# EasyEDA Pro project ESP32.epro, schematic Schematic1_1
Board Name: PCB2; Create Date: 2025-07-07; Page Name: P1; Project Name: NATHAN; Schematic Name: Schematic1_1; Update Date: 2025-07-10; Company: 嘉立创EDA; Page Size: A4; Version: V1.0
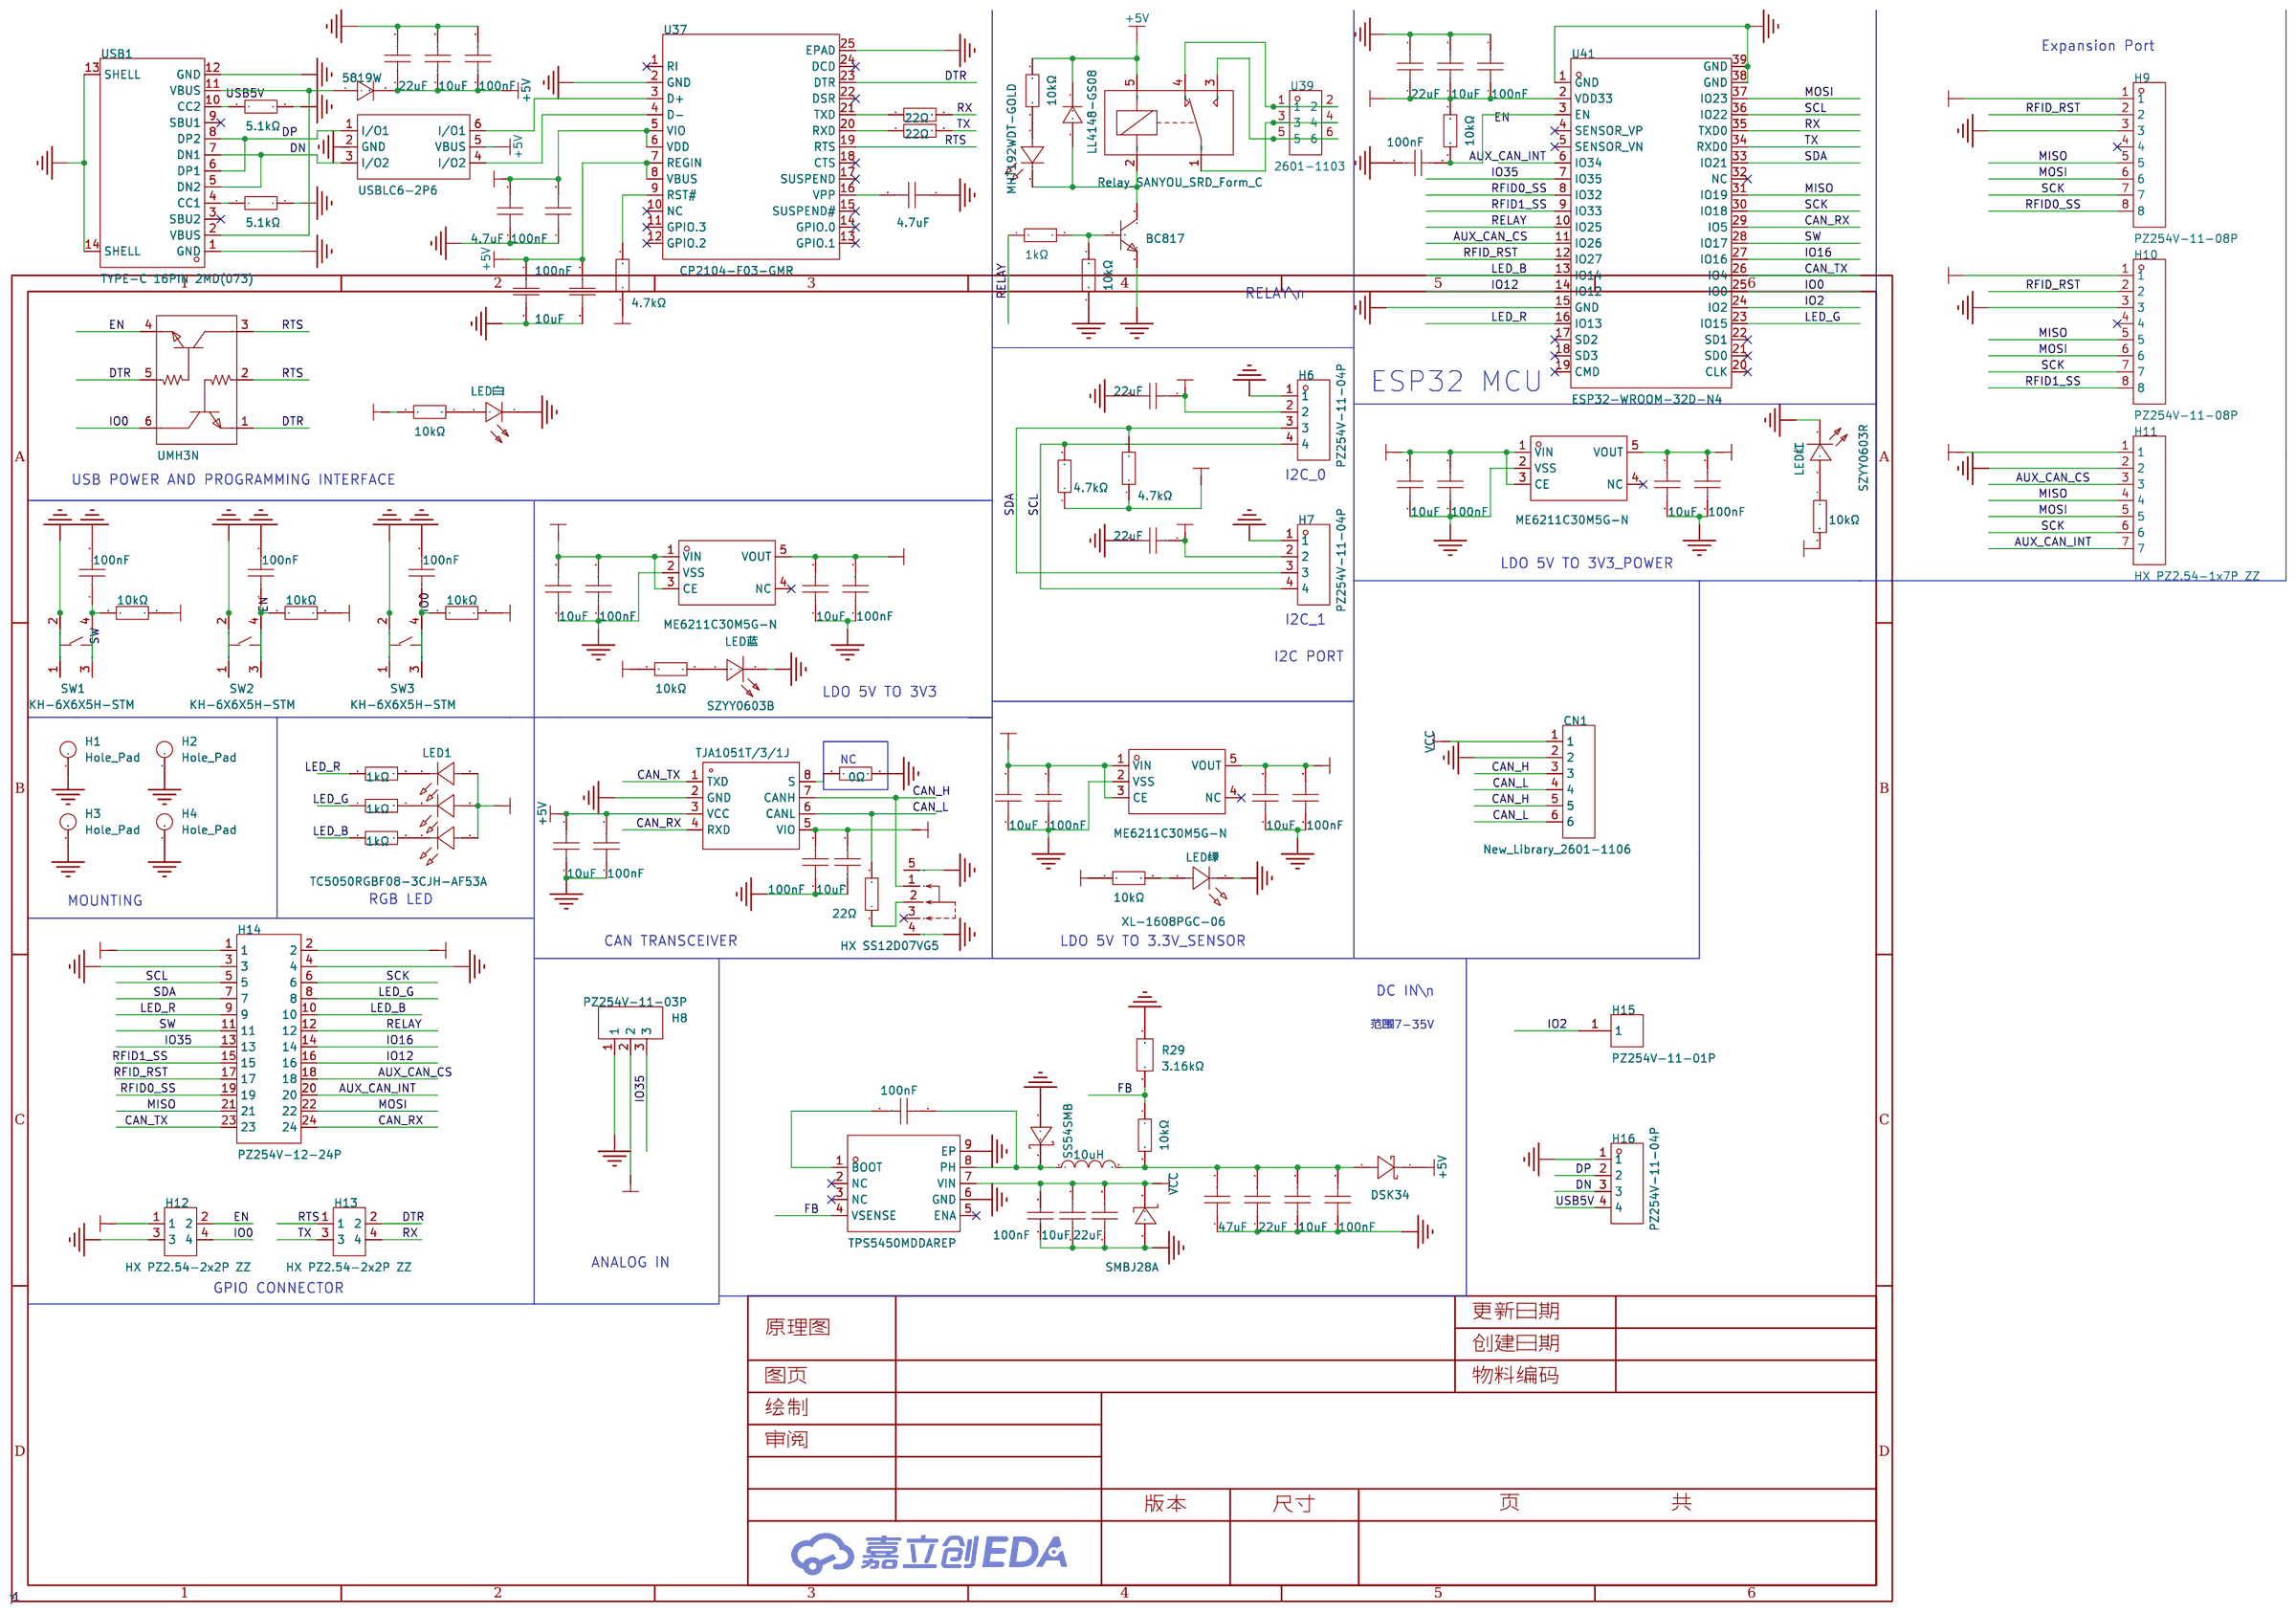
[diagram p0: schematic sheet]

## Parts
C1  22uF  [C0805]
C2  10uF  [C0603]
C3  100nF  [C0603]
C6  4.7uF  [C0603]
C9  100nF  [C0603]
C10  100nF  [C0603]
C11  100nF  [C0603]
C351  10uF  [C0603]
C352  10uF  [C0603]
C353  100nF  [C0603]
C354  100nF  [C0603]
C355  10uF  [C0603]
C356  100nF  [C0603]
C357  10uF  [C0603]
C358  100nF  [C0603]
C359  100nF  [C0603]
C360  4.7uF  [C0603]
C361  10uF  [C0603]
C362  100nF  [C0603]
C363  22uF  [C0805]
C364  22uF  [C0805]
C369  10uF  [C0603]
C370  10uF  [C0603]
C371  100nF  [C0603]
C372  100nF  [C0603]
C373  10uF  [C0603]
C374  100nF  [C0603]
C375  100nF  [C0603]
C376  10uF  [C0603]
C377  22uF  [C0805]
C378  10uF  [C0603]
C379  100nF  [C0603]
C380  100nF  [C0603]
C382  10uF  [C1206]
C383  22uF  [C1206]
C384  100nF  [C1206]
C385  47uF  [C1206]
C386  22uF  [C0805]
C387  10uF  [C0603]
C388  100nF  [C0603]
C389  100nF  [C0603]
CN1  New_Library_2601-1106  [CONN-TH_2601-1106]
D1  USBLC6-2P6  [SOT-666-6_L1.6-W1.2-P0.50-LS1.6-BL]
D2  5819W  [SOD-123_L2.7-W1.6-LS3.7-FD]
D3  LL4148-GS08  [SOD-80_L3.5-W1.5-RD]
D5  SS54SMB  [SMB_L4.6-W3.6-LS5.3-RD]
D6  SMBJ28A  [SMB_L4.6-W3.6-LS5.3-L-FD]
D7  DSK34  [SOD-123FL_L2.7-W1.8-LS3.8-RD]
H1  Hole_Pad  [MountingHole:MountingHole_3.2mm_M3_Pad_Via]
H2  Hole_Pad  [MountingHole:MountingHole_3.2mm_M3_Pad_Via]
H3  Hole_Pad  [MountingHole:MountingHole_3.2mm_M3_Pad_Via]
H4  Hole_Pad  [MountingHole:MountingHole_3.2mm_M3_Pad_Via]
H6  PZ254V-11-04P  [HDR-TH_4P-P2.54-V-M]
H7  PZ254V-11-04P  [HDR-TH_4P-P2.54-V-M]
H8  PZ254V-11-03P  [HDR-TH_3P-P2.54-V-M]
H9  PZ254V-11-08P  [HDR-TH_8P-P2.54-V-M]
H10  PZ254V-11-08P  [HDR-TH_8P-P2.54-V-M]
H11  HX PZ2.54-1x7P ZZ  [HDR-TH_7P-P2.54-V-M]
H12  HX PZ2.54-2x2P ZZ  [HDR-TH_HX-PZ2.54-2X2P-ZZ]
H13  HX PZ2.54-2x2P ZZ  [HDR-TH_HX-PZ2.54-2X2P-ZZ]
H14  PZ254V-12-24P  [HDR-TH_24P-P2.54-V-M-R2-C12-S2.54]
H15  PZ254V-11-01P  [HDR-TH_1P-P2.54-V-M]
H16  PZ254V-11-04P  [HDR-TH_4P-P2.54-V-M]
K1  SANYOU_SRD_Form_C  [Relay_THT:Relay_SPDT_SANYOU_SRD_Series_Form_C]
L12  10uH  [IND-SMD_L5.4-W5.2_FXL0530]
LED1  TC5050RGBF08-3CJH-AF53A  [LED-SMD_6P-L5.0-W5.0-TL_TC5050RGBF08]
LED白  NCD0603W1  [LED0603-RD]
LED红  SZYY0603R  [LED0603-R-RD]
LED绿  XL-1608PGC-06  [LED0603-RD_GREEN]
LED蓝  SZYY0603B  [LED0603-R-RD_BLUE]
Q1  UMH3N  [SC-70-6_L2.2-W1.3-P0.65-LS2.1-BR]
Q2  BC817  [SOT-23-3_L2.9-W1.3-P1.90-LS2.4-BR]
R1  5.1kΩ  [R0603]
R2  5.1kΩ  [R0603]
R4  22Ω  [R0603]
R5  22Ω  [R0603]
R7  10kΩ  [R0603]
R8  10kΩ  [R0603]
R9  10kΩ  [R0603]
R10  10kΩ  [R0603]
R11  10kΩ  [R0603]
R12  1kΩ  [R0603]
R13  1kΩ  [R0603]
R14  1kΩ  [R0603]
R15  0Ω  [R0603]
R16  22Ω  [R0603]
R17  4.7kΩ  [R0603]
R18  10kΩ  [R0603]
R19  10kΩ  [R0603]
R20  1kΩ  [R0603]
R21  4.7kΩ  [R0603]
R22  4.7kΩ  [R0603]
R23  10kΩ  [R0603]
R24  10kΩ  [R0603]
R25  10kΩ  [R0603]
R28  10kΩ  [R0603]
R29  3.16kΩ  [R0603]
SW1  KH-6X6X5H-STM  [SW-SMD_4P-L6.0-W6.0-P4.50-LS9.0_H5.0]
SW2  KH-6X6X5H-STM  [SW-SMD_4P-L6.0-W6.0-P4.50-LS9.0_H5.0]
SW3  KH-6X6X5H-STM  [SW-SMD_4P-L6.0-W6.0-P4.50-LS9.0_H5.0]
U31  ME6211C30M5G-N  [SOT-23-5_L2.9-W1.6-P0.95-LS2.8-BL]
U34  TJA1051T/3/1J  [SOIC-8_L4.9-W3.9-P1.27-LS6.0-BL]
U36  HX SS12D07VG5  [SW-TH_SS12D07VG3]
U37  CP2104-F03-GMR  [QFN-24_L4.0-W4.0-P0.50-BL-EP2.7]
U38  MHT192WDT-GOLD  [LED0603-RD-YELLOW]
U39  2601-1103  [CONN-TH_6P-P3.50_2601-1103]
U40  ME6211C30M5G-N  [SOT-23-5_L2.9-W1.6-P0.95-LS2.8-BL]
U41  ESP32-WROOM-32D-N4  [WIFIM-SMD_39P-L25.5-W18.0-P1.27-BL]
U42  ME6211C30M5G-N  [SOT-23-5_L2.9-W1.6-P0.95-LS2.8-BL]
U43  TPS5450MDDAREP  [POWERPAD-SO-8_L4.9-W3.9-P1.27-LS6.0-BL-EP]
USB1  TYPE-C 16PIN 2MD(073)  [USB-C-SMD_TYPE-C-6PIN-2MD-073]

## Library data of the parts
C1 C363 C364 C377 C386 = CGA0805X5R226M350MT: 容值:22uF;精度:±20%;额定电压:35V;材质(温度系数):X5R;; LCSC Part Name: 22uF ±20% 35V; Supplier Part: C6119901; Manufacturer: HRE(芯声); Supplier Footprint: 0805; JLCPCB Part Class: 扩展库; Datasheet: https://atta.szlcsc.com/upload/public/pdf/source/20231129/D589D0CC4D260F7AC3A77E53B455CCB3.pdf; Supplier: LCSC; Tolerance: ±20%; Voltage Rated: 35V; Temperature Coefficient: X5R
C2 C351 C352 C355 C357 C361 C369 C370 C373 C376 C378 C387 = CL10A106MA8NRNC: 容值:10uF;精度:±20%;额定电压:25V;材质(温度系数):X5R;; LCSC Part Name: 10uF ±20% 25V; Supplier Part: C96446; Manufacturer: SAMSUNG(三星); Supplier Footprint: 0603; JLCPCB Part Class: 基础库; Datasheet: https://atta.szlcsc.com/upload/public/pdf/source/20160218/1457707763339.pdf; Supplier: LCSC; Tolerance: ±20%; Voltage Rated: 25V; Temperature Coefficient: X5R
C3 C9-C11 C353 C354 C356 C358 C359 C362 C371 C372 C374 C375 C379 C380 C388 C389 = CGA0603X7R104K500JT: 容值:100nF;精度:±10%;额定电压:50V;温度系数:X7R;; LCSC Part Name: 100nF ±10% 50V; Supplier Part: C6119867; Manufacturer: HRE(芯声); Supplier Footprint: 0603; JLCPCB Part Class: 扩展库; Datasheet: https://atta.szlcsc.com/upload/public/pdf/source/20250103/C44077DA9E7B3EFAE02F22B6D3D1CBC9.pdf; Supplier: LCSC; Tolerance: ±10%; Voltage Rating: 50V; Temperature Coefficient: X7R
C6 C360 = CGA0603X5R475K250JT: 容值:4.7uF;精度:±10%;额定电压:25V;温度系数:X5R;; LCSC Part Name: 4.7uF ±10% 25V; Supplier Part: C6119856; Manufacturer: HRE(芯声); Supplier Footprint: 0603; JLCPCB Part Class: 扩展库; Supplier: LCSC; Tolerance: ±10%; Voltage Rating: 25V; Temperature Coefficient: X5R
C382 = HGC1206R5106K500NSPJ: 容值:10uF;精度:±10%;额定电压:50V;温度系数:X5R;; LCSC Part Name: 10uF ±10% 50V; Supplier Part: C7432781; Manufacturer: Chinocera(华瓷); Supplier Footprint: 1206; JLCPCB Part Class: 扩展库; Datasheet: https://atta.szlcsc.com/upload/public/pdf/source/20240320/FAC3FEC40A78BC5CCCE96C232A94D860.pdf; Supplier: LCSC; Tolerance: ±10%; Voltage Rating: 50V; Temperature Coefficient: X5R
C383 = CGA1206X5R226M350NT: 容值:22uF;精度:±20%;额定电压:35V;温度系数:X5R;; LCSC Part Name: 22uF ±20% 35V; Supplier Part: C6119969; Manufacturer: HRE(芯声); Supplier Footprint: 1206; JLCPCB Part Class: 扩展库; Supplier: LCSC; Tolerance: ±20%; Voltage Rating: 35V; Temperature Coefficient: X5R
C384 = CL31B104KBCNNNC: 容值:100nF;精度:±10%;额定电压:50V;材质(温度系数):X7R;; LCSC Part Name: 100nF ±10% 50V; Supplier Part: C24497; Manufacturer: SAMSUNG(三星); Supplier Footprint: 1206; JLCPCB Part Class: 基础库; Datasheet: https://atta.szlcsc.com/upload/public/pdf/source/20160218/1457707763339.pdf; Supplier: LCSC; Tolerance: ±10%; Voltage Rated: 50V; Temperature Coefficient: X7R
C385 = HGC1206R5476M250NSPJ: 容值:47uF;精度:±20%;额定电压:25V;温度系数:X5R;; LCSC Part Name: 47uF ±20% 25V; Supplier Part: C22367835; Manufacturer: Chinocera(华瓷); Supplier Footprint: 1206; JLCPCB Part Class: 扩展库; Datasheet: https://atta.szlcsc.com/upload/public/pdf/source/20240326/E6CB0DC43BB858B74F4352229FABFDCA.pdf; Supplier: LCSC; Tolerance: ±20%; Voltage Rating: 25V; Temperature Coefficient: X5R
CN1 = 2601-1106: Supplier Part: C9900153774; Supplier Footprint: 6P; Supplier: LCSC
D1 = USBLC6-2P6_C2827693: 极性:单向;反向截止电压(Vrwm):5V;最大钳位电压:14V;峰值脉冲电流(Ipp):5.5A;峰值脉冲功率(Ppp):80W;击穿电压:6V;; LCSC Part Name: MSL=3; Supplier Part: C2827693; Manufacturer: TECH PUBLIC(台舟); Supplier Footprint: SOT-666-6; JLCPCB Part Class: 扩展库; Datasheet: https://atta.szlcsc.com/upload/public/pdf/source/20210810/36353A9194EA9F4E33F8AE18BE051AEA.pdf; Supplier: LCSC; polarity: 单向; Reverse Stand-Off Voltage (Vrwm): 5V; Maximum Clamping Voltage: 14V; Peak Pulse Current (Ipp): 5.5A; Peak Pulse Power Dissipation (Ppp): 80W; Breakdown Voltage: 6V; Reverse Leakage Current (Ir): 80nA; Number of Lines: 双路; Operating Temperature: -55℃~+125℃; level of protection: IEC 61000-4-2; Type: ESD
D2 = 5819W: 正向压降(Vf):900mV@3A;直流反向耐压(Vr):40V;整流电流:1A;; Supplier Part: C42401890; Manufacturer: MOT(仁懋); Supplier Footprint: SOD-123; Datasheet: https://atta.szlcsc.com/upload/public/pdf/source/20241129/2D139EC0BD1168ECF15291E132570738.pdf; Supplier: LCSC; Voltage - Forward(Vf@If): 900mV@3A; Voltage - DC Reverse(Vr): 40V; Current - Rectified: 1A; Reverse Leakage Current (Ir): 1mA
D3 = LL4148-GS08: 二极管配置:-;正向压降(Vf):860mV@50mA;直流反向耐压(Vr):75V;整流电流:300mA;反向恢复时间(Trr):-;; Supplier Part: C68883; Manufacturer: VISHAY(威世); Supplier Footprint: MiniMELF; JLCPCB Part Class: 扩展库; Datasheet: https://atta.szlcsc.com/upload/public/pdf/source/20160803/1470206543327.pdf; Supplier: LCSC; Voltage - Forward(Vf@If): 860mV@50mA; Voltage - DC Reverse(Vr): 75V; Current - Rectified: 300mA; Reverse Leakage Current (Ir): 5uA@75V
D5 = SS54SMB: schottky,5A 40V VF&lt;0.55V DO-214AA SMB; LCSC Part Name: SS54 SMB; Supplier Part: C511854; Manufacturer: BORN(伯恩半导体); Supplier Footprint: SMB; JLCPCB Part Class: 扩展库; Datasheet: https://atta.szlcsc.com/upload/public/pdf/source/20200413/C511854_F7D668554D39129E820C7896E4694DA5.pdf; Supplier: LCSC
D6 = SMBJ28A: 极性:Unidirectional;峰值脉冲电流（10/1000us）:13.2A;箝位电压:45.4V;击穿电压（最小值）:31.1V;反向关断电压（典型值）:28V;; Supplier Part: C356769; Manufacturer: JJW(捷捷微); Supplier Footprint: SMB(DO-214AA); JLCPCB Part Class: 扩展库; Datasheet: https://atta.szlcsc.com/upload/public/pdf/source/20181226/C356769_111367A690C2F4EEBB1E8F2BF22E2686.pdf; Supplier: LCSC
D7 = DSK34_C7502709: 二极管配置:独立式;正向压降(Vf):550mV@3A;直流反向耐压(Vr):40V;平均整流电流(Io):3A;; LCSC Part Name: 电压:40V 电流:3A; Supplier Part: C7502709; Manufacturer: 宏迦橙; Supplier Footprint: SOD-123FL; JLCPCB Part Class: Extended Part; Datasheet: https://atta.szlcsc.com/upload/public/pdf/source/20230828/8ECF110B7E3B5231119B5EFF852BA7DE.pdf; Supplier: LCSC; Diode Configuration: 独立式; Forward Voltage (Vf@If): 550mV@3A; Reverse Voltage (Vr): 40V; Average Rectified Current (Io): 3A; Reverse Leakage Current (Ir): 500uA; Peak forward surge current: 80A
H1-H4 = Mechanical_MountingHole_Pad: Mounting Hole with connection
H6 H7 H16 = PZ254V-11-04P: 插针结构:1x4P;间距:2.54mm;行距:-;圆针/方针:方针;安装类型:直插;排数:单排;总PIN位数:4P;额定电流:3A;额定电压:250V;配合针长度:6mm;塑高:2.5mm;端接针长度:3mm;触头材质:-;工作温度范围:-40℃~+105℃;颜色:黑色;; LCSC Part Name: 间距:2.54mm 1x4P 直插 方针; Supplier Part: C2691448; Manufacturer: XFCN(兴飞); Supplier Footprint: 插件,P=2.54mm; JLCPCB Part Class: 扩展库; Datasheet: https://atta.szlcsc.com/upload/public/pdf/source/20200309/C492403_F9F19131791D08044AD4F84F8E751A34.pdf; Supplier: LCSC; Pin Structure: 1x4P; Pitch: 2.54mm; Circluar Pins/Square Pins: 方针; Mounting Type: 直插; Number of Rows: 单排; Number of Pins: 4P; Current Rating (Max): 3A; Voltage Rating (Max): 250V; Length of Mating Pin: 6mm; Insulation Height: 2.5mm; Length of End Connection Pin: 3mm; Operating Temperature Range: -40℃~+105℃; Color: 黑色
H8 = PZ254V-11-03P: 插针结构:1x3P;间距:2.54mm;行距:-;圆针/方针:方针;安装方式:直插;排数:单排;总PIN位数:3P;额定电流:3A;额定电压:250V;配合针长度:6mm;塑高:2.5mm;端接针长度:3mm;工作温度:-40℃~+105℃;颜色:黑色;; LCSC Part Name: 1x3P 间距:2.54mm 方针 直插; Supplier Part: C2937625; Manufacturer: XFCN(兴飞); Supplier Footprint: 插件,P=2.54mm; JLCPCB Part Class: 扩展库; Datasheet: https://atta.szlcsc.com/upload/public/pdf/source/20200309/C492402_8335C3D49C4E4C618838D59BB1D024C1.pdf; Supplier: LCSC; Pin Structure: 1x3P; Pitch: 2.54mm; Circluar Pins/Square Pins: 方针; Mounting Type: 直插; Number of Rows: 单排; Number of Pins: 3P; Current Rating: 3A; Voltage Rating (Max): 250V; Length of Mating Pin: 6mm; Insulation Height: 2.5mm; Length of End Connection Pin: 3mm; Operating Temperature: -40℃~+105℃; Color: 黑色
H9 H10 = PZ254V-11-08P: 插针结构:1x8P;间距:2.54mm;行距:-;圆针/方针:方针;安装类型:直插;排数:单排;总PIN位数:8P;额定电流:-;额定电压:-;配合针长度:6mm;塑高:2.5mm;端接针长度:3mm;触头材质:黄铜;触头镀层:-;工作温度范围:-40℃~+105℃;颜色:黑色;; LCSC Part Name: 间距:2.54mm 1x8P 直插 方针; Supplier Part: C492407; Manufacturer: XFCN(兴飞); Supplier Footprint: 插件,P=2.54mm; JLCPCB Part Class: 扩展库; Datasheet: https://atta.szlcsc.com/upload/public/pdf/source/20200309/C492407_83A6FB26A2233368EDB9516968EC6149.pdf; Supplier: LCSC; Pin Structure: 1x8P; Pitch: 2.54mm; Circluar Pins/Square Pins: 方针; Mounting Type: 直插; Number of Rows: 单排; Number of Pins: 8P; Length of Mating Pin: 6mm; Insulation Height: 2.5mm; Length of End Connection Pin: 3mm; Contact Material: 黄铜; Operating Temperature Range: -40℃~+105℃; Color: 黑色
H11 = HX PZ2.54-1x7P ZZ: 插针结构:1x7P;间距:2.54mm;行距:-;圆针/方针:方针;安装方式:直插;排数:单排;总PIN位数:7P;额定电流:3A;额定电压:-;配合针长度:6mm;塑高:2.5mm;端接针长度:3mm;触头材质:黄铜;触头镀层:金;工作温度:-40℃~+105℃;颜色:黑色;; LCSC Part Name: 1x7P 间距:2.54mm 方针 直插; Supplier Part: C32713273; Manufacturer: hanxia(韩下); Supplier Footprint: 插件,P=2.54mm; JLCPCB Part Class: 扩展库; Datasheet: https://atta.szlcsc.com/upload/public/pdf/source/20240723/943E46E17BFD6F6457BB8E431625ECB3.pdf; Supplier: LCSC; Pin Structure: 1x7P; Pitch: 2.54mm; Circluar Pins/Square Pins: 方针; Mounting Type: 直插; Number of Rows: 单排; Number of Pins: 7P; Current Rating: 3A; Length of Mating Pin: 6mm; Insulation Height: 2.5mm; Length of End Connection Pin: 3mm; Contact Material: 黄铜; Contact Plating: 金; Operating Temperature: -40℃~+105℃; Color: 黑色
H12 H13 = HX PZ2.54-2x2P ZZ: 插针结构:2x2P;间距:2.54mm;行距:2.54mm;圆针/方针:方针;安装方式:直插;排数:双排;总PIN位数:4P;额定电流:3A;额定电压:-;配合针长度:6mm;塑高:2.5mm;端接针长度:3mm;触头材质:黄铜;触头镀层:金;工作温度:-40℃~+105℃;颜色:黑色;; LCSC Part Name: 2x2P 间距:2.54mm 方针 直插; Supplier Part: C32713275; Manufacturer: hanxia(韩下); Supplier Footprint: 插件,P=2.54mm; JLCPCB Part Class: 扩展库; Datasheet: https://atta.szlcsc.com/upload/public/pdf/source/20240723/CE5FF0E3D3DC0CA9D26CA3411A561CD4.pdf; Supplier: LCSC; Pin Structure: 2x2P; Pitch: 2.54mm; Row Spacing: 2.54mm; Circluar Pins/Square Pins: 方针; Mounting Type: 直插; Number of Rows: 双排; Number of Pins: 4P; Current Rating: 3A; Length of Mating Pin: 6mm; Insulation Height: 2.5mm; Length of End Connection Pin: 3mm; Contact Material: 黄铜; Contact Plating: 金; Operating Temperature: -40℃~+105℃; Color: 黑色
H14 = PZ254V-12-24P: 插针结构:2x12P;间距:2.54mm;行距:2.54mm;圆针/方针:方针;安装方式:直插;排数:双排;总PIN位数:24P;额定电流:-;额定电压:-;配合针长度:6mm;塑高:2.5mm;端接针长度:3mm;触头材质:黄铜;触头镀层:-;工作温度:-40℃~+105℃;颜色:黑色;; LCSC Part Name: 2x12P 间距:2.54mm 方针 直插; Supplier Part: C492429; Manufacturer: XFCN(兴飞); Supplier Footprint: 插件,P=2.54mm; JLCPCB Part Class: 扩展库; Datasheet: https://atta.szlcsc.com/upload/public/pdf/source/20200309/C492429_A90DEF30FD4D9CDC2C3DDFC5EAF9C00B.pdf; Supplier: LCSC; Pin Structure: 2x12P; Pitch: 2.54mm; Row Spacing: 2.54mm; Circluar Pins/Square Pins: 方针; Mounting Type: 直插; Number of Rows: 双排; Number of Pins: 24P; Length of Mating Pin: 6mm; Insulation Height: 2.5mm; Length of End Connection Pin: 3mm; Contact Material: 黄铜; Operating Temperature: -40℃~+105℃; Color: 黑色
H15 = PZ254V-11-01P: 插针结构:1x1P;间距:2.54mm;行距:-;圆针/方针:方针;安装方式:直插;排数:单排;总PIN位数:1P;额定电流:-;额定电压:-;配合针长度:6mm;塑高:2.5mm;端接针长度:3mm;触头材质:黄铜;触头镀层:-;工作温度:-40℃~+105℃;颜色:黑色;; LCSC Part Name: 1x1P 间距:2.54mm 方针 直插; Supplier Part: C492400; Manufacturer: XFCN(兴飞); Supplier Footprint: 插件,P=2.54mm; JLCPCB Part Class: 扩展库; Datasheet: https://atta.szlcsc.com/upload/public/pdf/source/20200309/C492400_46876A5B545F5AE6B8D4A09C46E276E8.pdf; Supplier: LCSC; Pin Structure: 1x1P; Pitch: 2.54mm; Circluar Pins/Square Pins: 方针; Mounting Type: 直插; Number of Rows: 单排; Number of Pins: 1P; Length of Mating Pin: 6mm; Insulation Height: 2.5mm; Length of End Connection Pin: 3mm; Contact Material: 黄铜; Operating Temperature: -40℃~+105℃; Color: 黑色
K1 = Relay_SANYOU_SRD_Form_C: User doc link: http://www.sanyourelay.ca/public/products/pdf/SRD.pdf
L12 = FXL0530-100-M: 电感值:10uH;精度:±20%;额定电流:3.2A;饱和电流(Isat):3.5A;类型:一体成型电感;; LCSC Part Name: 10uH ±20% 3.5A; Supplier Part: C177248; Manufacturer: cjiang(长江微电); Supplier Footprint: SMD,5.2x5.4mm; JLCPCB Part Class: 扩展库; Datasheet: https://atta.szlcsc.com/upload/public/pdf/source/20230516/4BF6F9C76E81720F52A39ED5FFFA18B4.pdf; Supplier: LCSC; Tolerance: ±20%; Rated Current: 3.2A; Saturation Current (Isat): 3.5A; DC Resistance (DCR): 125mΩ; Type: 一体成型电感
LED1 = TC5050RGBF08-3CJH-AF53A: 5050RGB，0.2W 20mA; LCSC Part Name: RGB三色; Supplier Part: C784540; Manufacturer: TCWIN(天成); Supplier Footprint: SMD5050; JLCPCB Part Class: 扩展库; Datasheet: https://atta.szlcsc.com/upload/public/pdf/source/20230731/34B1F7048EB892D234C2083EEE9FB085.pdf; Supplier: LCSC; Operating Temperature: -40℃~+85℃
LED白 = NCD0603W1: 发光颜色:白色;正向电压(VF):2.6V~3.6V;功率:72mW;正向电流:5mA;透镜颜色:雾状黄透镜;发光强度:200mcd~300mcd;发光角度:130°;工作温度:-30℃~+85℃;; Supplier Part: C84265; Manufacturer: 国星光电; Supplier Footprint: 0603; JLCPCB Part Class: 扩展库; Datasheet: https://atta.szlcsc.com/upload/public/pdf/source/20200820/C84265_479E6193713348A548E5CD6D9278BF16.pdf; Supplier: LCSC; Emitted Color: 白色; Forward Voltage (VF): 2.6V~3.6V; Power Dissipation: 72mW; Forward Current: 5mA; Lens Color: 雾状黄透镜; Luminous Intensity: 200mcd~300mcd; Viewing Angle: 130°; Operating Temperature: -30℃~+85℃
LED红 = SZYY0603R: 发光颜色:红色;功率:40mW;正向电流:20mA;主波长:615nm~630nm;二极管配置:-;透镜颜色:无色透明透镜;色温:-;发光角度:120°;载带方式:-;工作温度:-40℃~+85℃;; LCSC Part Name: 红灯; Supplier Part: C434419; Manufacturer: yongyu(永裕光电); Supplier Footprint: 0603; JLCPCB Part Class: 扩展库; Datasheet: https://atta.szlcsc.com/upload/public/pdf/source/20191204/C434419_0B955C1F73FF88449D9A795B6FF49070.pdf; Supplier: LCSC; Emitted Color: 红色; Power Dissipation: 40mW; Forward Current: 20mA; Dominant Wavelength: 615nm~630nm; Peak Wavelength: 645nm; Lens Color: 无色透明透镜; Viewing Angle: 120°; Operating Temperature: -40℃~+85℃
LED绿 = XL-1608PGC-06: 灯头类型:-;发光颜色:翠绿色;正向电压(VF):2.6V~3V;功率:75mW;正向电流:5mA;主波长:505nm~540nm;二极管配置:-;透镜颜色:绿色透镜;色温:-;发光强度:299mcd;发光角度:130°;载带方式:正贴;工作温度:-;; Supplier Part: C7371905; Manufacturer: XINGLIGHT(成兴光); Supplier Footprint: 0603; JLCPCB Part Class: 扩展库; Datasheet: https://atta.szlcsc.com/upload/public/pdf/source/20240218/2F8A7AF596DEEB38157DAB7856E382C0.pdf; Supplier: LCSC; Emitted Color: 翠绿色; Forward Voltage (VF): 2.6V~3V; Power Dissipation: 75mW; Forward Current: 5mA; Dominant Wavelength: 505nm~540nm; Peak Wavelength: 530nm; Lens Color: 绿色透镜; Luminous Intensity: 299mcd; Viewing Angle: 130°; Mounting Sytle: 正贴
LED蓝 = SZYY0603B: 发光颜色:蓝色;功率:100mW;正向电流:5mA;主波长:460nm~475nm;二极管配置:-;透镜颜色:无色透明透镜;色温:-;发光角度:120°;载带方式:-;工作温度:-40℃~+85℃;; LCSC Part Name: 蓝灯; Supplier Part: C434421; Manufacturer: yongyu(永裕光电); Supplier Footprint: 0603; JLCPCB Part Class: 扩展库; Datasheet: https://atta.szlcsc.com/upload/public/pdf/source/20191204/C434421_A4F05E4DF64B0F36639806529E783B5C.pdf; Supplier: LCSC; Emitted Color: 蓝色; Power Dissipation: 100mW; Forward Current: 5mA; Dominant Wavelength: 460nm~475nm; Peak Wavelength: 469nm; Lens Color: 无色透明透镜; Viewing Angle: 120°; Operating Temperature: -40℃~+85℃
Q1 = UMH3N: 晶体管类型:-;集射极击穿电压(Vceo):50V;集电极电流(Ic):100mA;耗散功率(Pd):150mW;直流电流增益(hFE):100@1mA,5V;; Supplier Part: C62892; Manufacturer: CJ(江苏长电/长晶); Supplier Footprint: SC-70-6(SOT-363); JLCPCB Part Class: 扩展库; Datasheet: https://atta.szlcsc.com/upload/public/pdf/source/20151109/1457707575095.pdf; Supplier: LCSC; Collector - Emitter Voltage VCEO: 50V; Current - Collector(Ic): 100mA; Pd - Power Dissipation: 150mW; DC Current Gain: 100@1mA,5V; Input Resistor: 6.11kΩ; Operating Temperature: -55℃~+150℃
Q2 = BC817_C916383: 晶体管类型:NPN;集电极电流(Ic):500mA;集射极击穿电压(Vceo):45V;耗散功率(Pd):300mW;直流电流增益(hFE):-;; Supplier Part: C916383; Manufacturer: JSMSEMI(杰盛微); Supplier Footprint: SOT-23; JLCPCB Part Class: 扩展库; Datasheet: https://atta.szlcsc.com/upload/public/pdf/source/20230630/78AB950D26E0439A5E0071F02FAA6E46.pdf; Supplier: LCSC; type: NPN; Current - Collector(Ic): 500mA; Collector - Emitter Voltage VCEO: 45V; Pd - Power Dissipation: 300mW; Transition frequency(fT): 100MHz; Current - Collector Cutoff: 100nA; Vce Saturation(VCE(sat)): 700mV
R1 R2 = 0603WAF5101T5E: 电阻类型:厚膜电阻;阻值:5.1kΩ;精度:±1%;功率:100mW;最大工作电压:75V;温度系数:±100ppm/℃;; LCSC Part Name: 5.1kΩ ±1% 100mW 厚膜电阻; Supplier Part: C23186; Manufacturer: UNI-ROYAL(厚声); Supplier Footprint: 0603; JLCPCB Part Class: 基础库; Datasheet: https://atta.szlcsc.com/upload/public/pdf/source/20200306/C422600_1E6D84923E4A46A82E41ADD87F860B5C.pdf; Supplier: LCSC; Type: 厚膜电阻; Tolerance: ±1%; Power(Watts): 100mW; Overload Voltage (Max): 75V; Temperature Coefficient: ±100ppm/℃; Operating Temperature Range: -55℃~+155℃
R4 R5 R16 = 0603WAF220JT5E: 电阻类型:厚膜电阻;阻值:22Ω;精度:±1%;功率:100mW;最大工作电压:75V;温度系数:±100ppm/℃;; LCSC Part Name: 22Ω ±1% 100mW 厚膜电阻; Supplier Part: C23345; Manufacturer: UNI-ROYAL(厚声); Supplier Footprint: 0603; JLCPCB Part Class: 基础库; Datasheet: https://atta.szlcsc.com/upload/public/pdf/source/20200306/C422600_1E6D84923E4A46A82E41ADD87F860B5C.pdf; Supplier: LCSC; Type: 厚膜电阻; Tolerance: ±1%; Power(Watts): 100mW; Overload Voltage (Max): 75V; Temperature Coefficient: ±100ppm/℃; Operating Temperature Range: -55℃~+155℃
R7-R11 R18 R19 R23-R25 R28 = 0603WAF1002T5E: 电阻类型:厚膜电阻;阻值:10kΩ;精度:±1%;功率:100mW;工作电压:75V;温度系数:±100ppm/℃;; LCSC Part Name: 厚膜电阻 10kΩ ±1% 100mW; Supplier Part: C25804; Manufacturer: UNI-ROYAL(厚声); Supplier Footprint: 0603; JLCPCB Part Class: 基础库; Datasheet: https://atta.szlcsc.com/upload/public/pdf/source/20200306/C422600_1E6D84923E4A46A82E41ADD87F860B5C.pdf; Supplier: LCSC; Type: 厚膜电阻; Tolerance: ±1%; Power(Watts): 100mW; Voltage-Supply(Max): 75V; Temperature Coefficient: ±100ppm/℃; Operating Temperature: -55℃~+155℃
R12-R14 R20 = 0603WAF1001T5E: 电阻类型:厚膜电阻;阻值:1kΩ;精度:±1%;功率:100mW;最大工作电压:75V;温度系数:±100ppm/℃;; LCSC Part Name: 1kΩ ±1% 100mW 厚膜电阻; Supplier Part: C21190; Manufacturer: UNI-ROYAL(厚声); Supplier Footprint: 0603; JLCPCB Part Class: 基础库; Datasheet: https://atta.szlcsc.com/upload/public/pdf/source/20200306/C422600_1E6D84923E4A46A82E41ADD87F860B5C.pdf; Supplier: LCSC; Type: 厚膜电阻; Tolerance: ±1%; Power(Watts): 100mW; Overload Voltage (Max): 75V; Temperature Coefficient: ±100ppm/℃; Operating Temperature Range: -55℃~+155℃
R15 = 0603WAF0000T5E: 电阻类型:厚膜电阻;阻值:0Ω;精度:±1%;功率:100mW;最大工作电压:75V;; LCSC Part Name: 0Ω ±1% 100mW 厚膜电阻; Supplier Part: C21189; Manufacturer: UNI-ROYAL(厚声); Supplier Footprint: 0603; JLCPCB Part Class: 基础库; Datasheet: https://atta.szlcsc.com/upload/public/pdf/source/20200306/C422600_1E6D84923E4A46A82E41ADD87F860B5C.pdf; Supplier: LCSC; Type: 厚膜电阻; Tolerance: ±1%; Power(Watts): 100mW; Overload Voltage (Max): 75V; Operating Temperature Range: -55℃~+155℃
R17 R21 R22 = 0603WAF4701T5E: 电阻类型:厚膜电阻;阻值:4.7kΩ;精度:±1%;功率:100mW;最大工作电压:75V;温度系数:±100ppm/℃;; LCSC Part Name: 4.7kΩ ±1% 100mW 厚膜电阻; Supplier Part: C23162; Manufacturer: UNI-ROYAL(厚声); Supplier Footprint: 0603; JLCPCB Part Class: 基础库; Datasheet: https://atta.szlcsc.com/upload/public/pdf/source/20200306/C422600_1E6D84923E4A46A82E41ADD87F860B5C.pdf; Supplier: LCSC; Type: 厚膜电阻; Tolerance: ±1%; Power(Watts): 100mW; Overload Voltage (Max): 75V; Temperature Coefficient: ±100ppm/℃; Operating Temperature Range: -55℃~+155℃
R29 = FRC0603F3161TS: 电阻类型:厚膜电阻;阻值:3.16kΩ;精度:±1%;功率:100mW;最大工作电压:75V;温度系数:±100ppm/℃;; LCSC Part Name: 3.16kΩ ±1% 100mW 厚膜电阻; Supplier Part: C2930087; Manufacturer: FOJAN(富捷); Supplier Footprint: 0603; JLCPCB Part Class: 扩展库; Datasheet: https://atta.szlcsc.com/upload/public/pdf/source/20211221/925EC7D7225764EE0046F22065062C87.pdf; Supplier: LCSC; Type: 厚膜电阻; Tolerance: ±1%; Power(Watts): 100mW; Overload Voltage (Max): 75V; Temperature Coefficient: ±100ppm/℃; Operating Temperature Range: -55℃~+155℃
SW1-SW3 = KH-6X6X5H-STM: 电路结构:单刀单掷;按钮形状:圆形按钮;安装方式:立贴;开关长度:6mm;开关宽度:6mm;开关高度:5mm;带支架:不带;触点电流:50mA;额定电压(DC):12V;机械寿命:8万次;; LCSC Part Name: 6*6*5mm 立贴 轻触开关; Supplier Part: C2837531; Manufacturer: kinghelm(金航标); Supplier Footprint: SMD; JLCPCB Part Class: 扩展库; Datasheet: https://atta.szlcsc.com/upload/public/pdf/source/20210608/C2837531_45E87AB996CE723B09405FF2EA209C4C.pdf; Supplier: LCSC; Circuit: 单刀单掷; Actuator Style: 圆形按钮; Mounting Style: 立贴; Switch Length: 6mm; Switch Width: 6mm; Switch Height: 5mm; Strike Gundam: 不带; Contact Current: 50mA; Voltage Rating (DC): 12V; Actuator/Cap Color: 黑色; Pin Style: 鸥翼型; Mechanical Life: 8万次
U31 U40 U42 = ME6211C30M5G-N: 输出类型:固定;最大输入电压:6V;输出电压:3V;最大输出电流:500mA;电源纹波抑制比(PSRR):-;输出极性:正极;; LCSC Part Name: 输入6V 输出3V 500mA; Supplier Part: C403651; Manufacturer: MICRONE(南京微盟); Supplier Footprint: SOT-23-5; JLCPCB Part Class: 扩展库; Datasheet: https://atta.szlcsc.com/upload/public/pdf/source/20190709/C403651_B6C31F2E850C49363974D5C4E4AF6FD2.pdf; Supplier: LCSC; Output Type: 固定; Maximum Input Voltage: 6V; Output Voltage: 3V; MAX Output Current: 500mA; Dropout Voltage: 210mV@(200mA); Output Polarity: 正极; Number of Outputs: 1
U34 = TJA1051T/3/1J: 类型:-;数据速率:5Mbps;; Supplier Part: C38695; Manufacturer: NXP(恩智浦); Supplier Footprint: SOIC-8-150mil; JLCPCB Part Class: 扩展库; Datasheet: https://www.nxp.com/docs/en/data-sheet/TJA1051.pdf; Supplier: LCSC; Data Rate: 5Mbps; Supply Voltage: 4.5V~5.5V; Supply Current: 5mA; Operating Temperature: -40℃~+150℃
U36 = HX SS12D07VG5: 电路结构:单刀双掷;安装方式:直插;开关颜色:黑色;额定电流:300mA;额定电压:50V;工作寿命:1万次;; LCSC Part Name: 柄长5mm 直插二档 滑动开关; Supplier Part: C5149827; Manufacturer: hanxia(韩下); Supplier Footprint: 插件; JLCPCB Part Class: 扩展库; Datasheet: https://atta.szlcsc.com/upload/public/pdf/source/20250218/B4530D8C2A56F967E8FB7869762EB22F.pdf; Supplier: LCSC; Circuit: 单刀双掷; Actuator Style: 矩形柱状; Termination Style: PC引脚; Length: 8.7mm; Width: 4.4mm; Switch Height: 9.7mm; Mounting Type: 直插; Actuator Color: 黑色; Current Rating: 300mA; Voltage Rating: 50V; Life: 1万次; Operating Temperature: -25℃~+70℃
U37 = CP2104-F03-GMR: 应用功能:USB转UART;接口协议:-;数据速率:2Mbps;; LCSC Part Name: 单片USB到UART桥接控制器 USB转UART桥接芯片; Supplier Part: C47742; Manufacturer: SKYWORKS/SILICON LABS(芯科); Supplier Footprint: QFN-24-EP(4x4); JLCPCB Part Class: 扩展库; Datasheet: https://atta.szlcsc.com/upload/public/pdf/source/20150504/1457707282429.pdf; Supplier: LCSC; Applications Function: USB转UART; Supply Voltage: 1.8V；3V~3.6V; Data Rate: 2Mbps; Operating Temperature: -40℃~+85℃
U38 = MHT192WDT-GOLD: 发光颜色:黄色;功率:60mW;正向电流:5mA;主波长:-;二极管配置:-;透镜颜色:雾状黄透镜;色温:-;发光角度:130°;载带方式:-;工作温度:-40℃~+85℃;; LCSC Part Name: 黄灯; Supplier Part: C2837383; Manufacturer: MEIHUA(美华); Supplier Footprint: 0603; JLCPCB Part Class: 扩展库; Datasheet: https://atta.szlcsc.com/upload/public/pdf/source/20210603/C2837383_668F4ACD0E233D894D29F8F8B9EAEF1D.pdf; Supplier: LCSC; Emitted Color: 黄色; Power Dissipation: 60mW; Forward Current: 5mA; Lens Color: 雾状黄透镜; Viewing Angle: 130°; Operating Temperature: -40℃~+85℃
U39 = 2601-1103: PCB 接线端子; 操作手柄; 1.5 mm2; 焊针间距 3.5 mm; 3极; 推入式笼夹; 1,50 mm2; 灰色; Supplier Part: C7472698; Manufacturer: WAGO(万可); Supplier Footprint: 插件,P=3.5mm; JLCPCB Part Class: 扩展库; Datasheet: https://atta.szlcsc.com/upload/public/pdf/source/20240516/26CB940F61CBBD7B4897536DBA61AF46.pdf; Supplier: LCSC
U41 = ESP32-WROOM-32D-N4: ESP32-WROOM-32D 集成 ESP32-D0WD，功能强大，用途广泛，可以用于低功耗传感器网络和要求极高的任务，例如语音编码、音频流和 MP3 解码等。; LCSC Part Name: 通用型Wi-Fi+BT+BLE MCU模组; Supplier Part: C473012; Manufacturer: ESPRESSIF(乐鑫); Supplier Footprint: SMD,18x25.5mm; JLCPCB Part Class: 扩展库; Datasheet: https://atta.szlcsc.com/upload/public/pdf/source/20191225/C473012_1E74417EE995DBCF17C94BD318A37DAB.pdf; Supplier: LCSC
U43 = TPS5450MDDAREP: 功能类型:降压型;输出类型:可调;工作电压:5.5V~36V;输出电压:1.221V~32.04V;输出电流:5A;; Supplier Part: C2071671; Manufacturer: TI(德州仪器); Supplier Footprint: SO-8; JLCPCB Part Class: 扩展库; Datasheet: https://www.ti.com/cn/lit/gpn/tps5450-ep; Supplier: LCSC; Function: 降压型; Output Type: 可调; Voltage - Supply: 5.5V~36V; Output Voltage: 1.221V~32.04V; Output Current: 5A; Frequency - Switching: 500kHz; Operating Temperature: -55℃~+125℃@(TJ); Synchronous Rectifier: 否; Number of Outputs: 1; Topology: 降压式; Switch tube (built-in/external): 内置
USB1 = TYPE-C 16PIN 2MD(073): 连接器类型:Type-C;协议标准:USB 3.1;公母:母;安装方式:卧贴;触点数量:16P;端口数量:1;额定电流 - 电源:3A;工作温度:-25℃~+85℃;; LCSC Part Name: Type-C 母 卧贴; Supplier Part: C2765186; Manufacturer: SHOU HAN(首韩); Supplier Footprint: SMD; JLCPCB Part Class: 扩展库; Datasheet: https://atta.szlcsc.com/upload/public/pdf/source/20250506/FFB74EDFDFA0AC372CE4A8E4F739CCEF.pdf; Supplier: LCSC; Connector Type: Type-C; Protocol Standard: USB 3.1; Gender: 母; Mounting Type: 卧贴; Number of Contacts: 16P; Number of Ports: 1; Current Rating-Power: 3A; Voltage Rating: 5V; Connect-Disconnect Life: 5千次; Detection color: 黑色; Operating Temperature: -25℃~+85℃

## Nets
3V3: C352.2 C354.2 C357.2 C358.2 H12.1 H14.2 LED1.1(+) LED1.2(+) LED1.3(+) R8.2 R9.2 R10.2 R11.2 U31.5(VOUT) U34.5(VIO)
3V3_POWER: C373.2 C375.2 C377.1 C378.1 C379.1 R24.2 R25.1 U41.2(VDD33) U42.5(VOUT)
+5V: C1.1 C2.1 C3.1 C351.2 C353.2 C355.2 C356.2 C361.2 C362.2 C369.2 C371.2 C374.2 C376.2 D1.5(VBUS) D2.2(C) D3.1(C) D7.1(K) H14.1 K1.5 R18.1 U31.1(VIN) U31.3(CE) U34.3(VCC) U37.7(REGIN) U37.8(VBUS) U40.1(VIN) U40.3(CE) U42.1(VIN) U42.3(CE)
GND: C1.2 C2.2 C3.2 C6.1 C9.2 C10.2 C11.2 C351.1 C352.1 C353.1 C354.1 C355.1 C356.1 C357.1 C358.1 C359.1 C360.1 C361.1 C362.1 C363.2 C364.2 C369.1 C370.1 C371.1 C372.1 C373.1 C374.1 C375.1 C376.1 C377.2 C378.2 C379.2 C380.2 C382.1 C383.1 C384.1 C385.1 C386.1 C387.1 C388.1 CN1.2 D1.2(GND) D5.2(A) D6.1(A) H1.1 H2.1 H3.1 H4.1 H6.1 H7.1 H8.1 H9.3 H10.3 H11.2 H12.3 H14.3 H14.4 H16.1 LED白.1(-) LED红.2(-) LED绿.1(K) LED蓝.2(-) Q2.2(E) R1.2 R2.2 R15.2 R19.2 R29.2 SW1.1 SW1.2 SW2.1 SW2.2 SW3.1 SW3.2 U31.2(VSS) U34.2(GND) U36.4 U36.5 U37.2(GND) U37.25(EPAD) U40.2(VSS) U41.1(GND) U41.15(GND) U41.38(GND) U41.39(GND) U42.2(VSS) U43.6(GND) U43.9(EP) USB1.1(GND) USB1.12(GND) USB1.13(SHELL) USB1.14(SHELL)
VCC: C382.2 C383.2 C384.2 CN1.1 D6.2(K) U43.7(VIN)
VDD: C359.2 C360.2 R7.1 R17.1 U37.5(VIO) U37.6(VDD)
3.3_SENSOR: C363.1 C364.1 C370.2 C372.2 H6.2 H7.2 H8.2 H9.1 H10.1 H11.1 R21.1 R22.1 R23.2 U40.5(VOUT)
AUX_CAN_CS: H11.3 H14.18 U41.11(IO26)
AUX_CAN_INT: H11.7 H14.20 U41.6(IO34)
CAN_H: CN1.3 CN1.5 U34.7(CANH) U36.1
CAN_L: CN1.4 CN1.6 R16.2 U34.6(CANL)
CAN_RX: H14.24 U34.4(RXD) U41.29(IO5)
CAN_TX: H14.23 U34.1(TXD) U41.26(IO4)
DN: D1.3(I/O2) H16.3 USB1.5(DN2) USB1.7(DN1)
DP: D1.1(I/O1) H16.2 USB1.6(DP1) USB1.8(DP2)
DTR: H13.2 Q1.1(E) Q1.5(B) U37.23(DTR)
EN: C10.1 C380.1 H12.2 Q1.4(E) R9.1 R25.2 SW2.3 SW2.4 U41.3(EN)
FB: R28.1 R29.1 U43.4(VSENSE)
IO0: C11.1 H12.4 Q1.6(C) R10.1 SW3.3 SW3.4 U41.25(IO0)
IO2: H15.1 U41.24(IO2)
IO12: H14.16 U41.14(IO12)
IO16: H14.14 U41.27(IO16)
IO35: H8.3 H14.13 U41.7(IO35)
LED_B: H14.10 R14.1 U41.13(IO14)
LED_G: H14.8 R13.1 U41.23(IO15)
LED_R: H14.9 R12.1 U41.16(IO13)
MISO: H9.5 H10.5 H11.4 H14.21 U41.31(IO19)
MOSI: H9.6 H10.6 H11.5 H14.22 U41.37(IO23)
RELAY: H14.12 R20.1 U41.10(IO25)
RFID0_SS: H9.8 H14.19 U41.8(IO32)
RFID1_SS: H10.8 H14.15 U41.9(IO33)
RFID_RST: H9.2 H10.2 H14.17 U41.12(IO27)
RTS: H13.1 Q1.2(B) Q1.3(C) U37.19(RTS)
RX: H13.4 R4.2 U41.35(TXD0)
SCK: H9.7 H10.7 H11.6 H14.6 U41.30(IO18)
SCL: H6.4 H7.4 H14.5 R21.2 U41.36(IO22)
SDA: H6.3 H7.3 H14.7 R22.2 U41.33(IO21)
SW: C9.1 H14.11 R8.1 SW1.3 SW1.4 U41.28(IO17)
TX: H13.3 R5.2 U41.34(RXD0)
USB5V: D2.1(A) H16.4 USB1.2(VBUS) USB1.11(VBUS)
$1N379: R1.1 USB1.10(CC2)
$1N383: R2.1 USB1.4(CC1)
$1N1005: D1.4(I/O2) U37.4(D-)
$1N1016: D1.6(I/O1) U37.3(D+)
$1N2492: LED白.2(+) R7.2
$1N3538: LED蓝.1(+) R11.1
$1N5096: LED1.4(-) R12.2
$1N5100: LED1.5(-) R13.2
$1N5105: LED1.6(-) R14.2
$1N6214: R15.1 U34.8(S)
$1N6447: R16.1 U36.2
$1N8585: C6.2 U37.16(VPP)
$1N8799: R4.1 U37.21(TXD)
$1N8801: R5.1 U37.20(RXD)
$1N8937: R17.2 U37.9(RST#)
$1N9236: R18.2 U38.2(A)
$1N9240: D3.2(A) K1.2 Q2.3(C) U38.1(K)
$1N9454: Q2.1(B) R19.1 R20.2
$1N9531: K1.4 U39.1 U39.2
$1N9535: K1.1 U39.3 U39.4
$1N9540: K1.3 U39.5 U39.6
$1N10830: LED绿.2(A) R23.1
$1N11549: LED红.1(+) R24.1
$1N13650: C389.1 D5.1(K) L12.1 U43.8(PH)
$1N13751: C385.2 C386.2 C387.2 C388.2 D7.2(A) L12.2 R28.2
$1N13789: C389.2 U43.1(BOOT)

Not connected (* = marked no-connect by the designer): H9 4*; H10 4*; U31 4(NC)*; U36 3*; U37 1(RI)* 10(NC)* 11(GPIO.3)* 12(GPIO.2)* 13(GPIO.1)* 14(GPIO.0)* 15(SUSPEND#)* 17(SUSPEND)* 18(CTS)* 22(DSR)* 24(DCD)*; U40 4(NC)*; U41 4(SENSOR_VP)* 5(SENSOR_VN)* 17(SD2)* 18(SD3)* 19(CMD)* 20(CLK)* 21(SD0)* 22(SD1)* 32(NC)*; U42 4(NC)*; U43 2(NC)* 3(NC)* 5(ENA)*; USB1 3(SBU2)* 9(SBU1)*

## Notes on the sheet
- Expansion Port
- RELAY\n
- ESP32 MCU
- USB POWER AND PROGRAMMING INTERFACE
- I2C_0
- LDO 5V TO 3V3_POWER
- I2C_1
- I2C PORT
- LDO 5V TO 3V3
- NC
- MOUNTING
- RGB LED
- CAN TRANSCEIVER
- LDO 5V TO 3.3V_SENSOR
- DC IN\n
- 范围7-35V
- ANALOG IN
- GPIO CONNECTOR
